# Altium schematic sheet MCU.SchDoc: MCU
size A4; Author: Miłosz Werner; Organization: Wrocław University of Science and Technology; Revision: 1.0; SheetNumber: 1; SheetTotal: 5
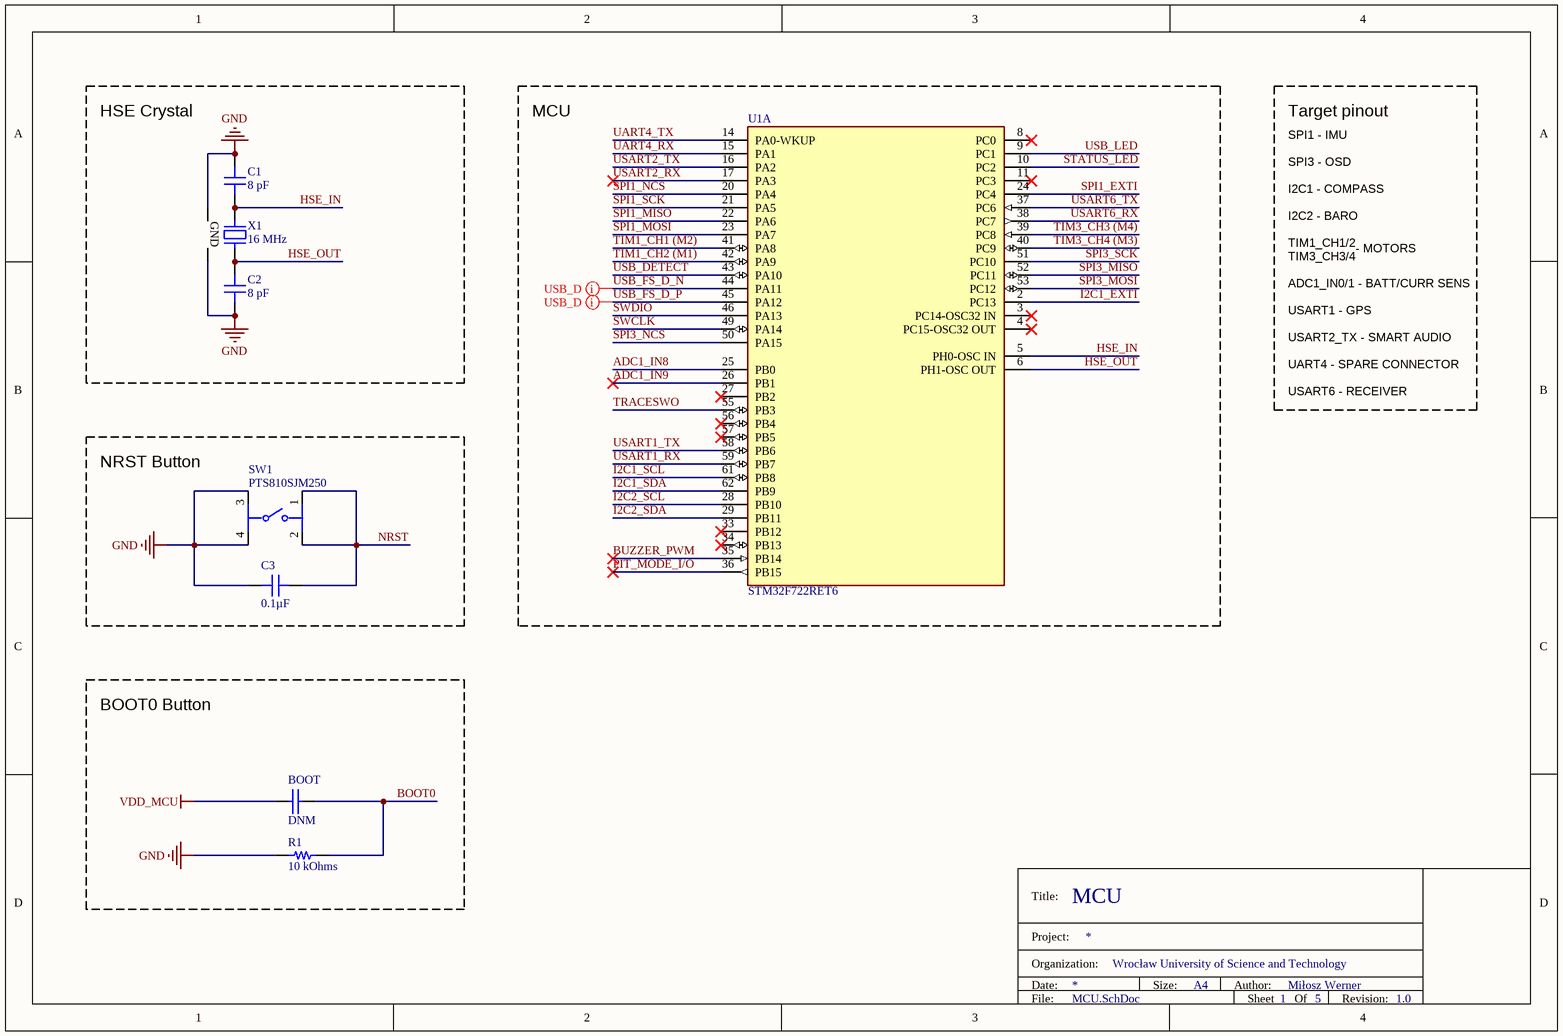
[diagram p0: MCU.SchDoc]

## Parts
BOOT  DNM  [C0603_DNM]  (no BOM)
C1  8 pF  [CAP 0603_1608]
C2  8 pF  [CAP 0603_1608]
C3  0.1µF  [CAP 0603_1608]
R1  10 kOhms  [RES 0603_1608]
SW1  PTS810SJM250  [FP-PTS810SJM250SMTRLFS-MFG]
U1  STM32F722RET6  [FP-LQFP64-5W-IPC_C]  (part A of 2)
X1  16 MHz  [NDK NX3225GA]

## Blocks framed on the sheet
HSE Crystal: C1 C2 X1
MCU: U1
NRST Button: C3 SW1
BOOT0 Button: BOOT R1

## Nets
GND: C1.2 C2.1 C3.2 R1.1 SW1.3 SW1.4 X1.2(GND) X1.4(GND)
VDD_MCU: BOOT.1
ADC1_IN8: U1.25(PB0)
ADC1_IN9: U1.26(PB1)
BOOT0: BOOT.2 R1.2
BUZZER_PWM: U1.35(PB14)
HSE_IN: C1.1 U1.5(PH0-OSC_IN) X1.1
HSE_OUT: C2.2 U1.6(PH1-OSC_OUT) X1.3
I2C1_EXTI: U1.2(PC13)
I2C1_SCL: U1.61(PB8)
I2C1_SDA: U1.62(PB9)
I2C2_SCL: U1.28(PB10)
I2C2_SDA: U1.29(PB11)
NRST: C3.1 SW1.1 SW1.2
PIT_MODE_I/O: U1.36(PB15)
SPI1_EXTI: U1.24(PC4)
SPI1_MISO: U1.22(PA6)
SPI1_MOSI: U1.23(PA7)
SPI1_NCS: U1.20(PA4)
SPI1_SCK: U1.21(PA5)
SPI3_MISO: U1.52(PC11)
SPI3_MOSI: U1.53(PC12)
SPI3_NCS: U1.50(PA15)
SPI3_SCK: U1.51(PC10)
STATUS_LED: U1.10(PC2)
SWCLK: U1.49(PA14)
SWDIO: U1.46(PA13)
TIM1_CH1 (M2): U1.41(PA8)
TIM1_CH2 (M1): U1.42(PA9)
TIM3_CH3 (M4): U1.39(PC8)
TIM3_CH4 (M3): U1.40(PC9)
TRACESWO: U1.55(PB3)
UART4_RX: U1.15(PA1)
UART4_TX: U1.14(PA0-WKUP)
USART1_RX: U1.59(PB7)
USART1_TX: U1.58(PB6)
USART2_RX: U1.17(PA3)
USART2_TX: U1.16(PA2)
USART6_RX: U1.38(PC7)
USART6_TX: U1.37(PC6)
USB_DETECT: U1.43(PA10)
USB_FS_D_N: U1.44(PA11)
USB_FS_D_P: U1.45(PA12)
USB_LED: U1.9(PC1)

Not connected (* = marked no-connect by the designer): U1 3(PC14-OSC32_IN)* 4(PC15-OSC32_OUT)* 8(PC0)* 11(PC3)* 27(PB2)* 33(PB12)* 34(PB13)* 56(PB4)* 57(PB5)*

## Layout directives
differential pair: USB_FS_D_N, USB_FS_D_P

## Notes on the sheet
- Target pinout
- SPI1 - IMU
- SPI3 - OSD
- I2C1 - COMPASS
- TIM1_CH1/2
- TIM3_CH3/4
- I2C2 - BARO
- - MOTORS
- ADC1_IN0/1 - BATT/CURR SENS
- USART1 - GPS
- USART2_TX - SMART AUDIO
- UART4 - SPARE CONNECTOR
- USART6 - RECEIVER
- Title:
- Date:
- File:
- Project:
- Organization:
- Size:
- A4
- Author:
- Sheet
- Of
- Revision:

## Library data of the parts
BOOT = CAP_0603_DNM: CAP 0603 DO NOT MOUNT
C1 C2 = CGA3E2C0G1H080D080AA: CAP CER 8PF 50V C0G 0603; manufacturer: TDK Corporation; Temperature Coefficient: C0G, NP0; Tolerance: ±0.5pF; Part Number: CGA3E2C0G1H080D080AA; Value: 8 pF; Applications: Automotive; Capacitance: 8 pF; componentlink1description: Datasheet; componentlink1url: https://product.tdk.com/info/en/catalog/datasheets/mlcc_automotive_general_en.pdf?ref_disty=digikey; componentlink2description: DigiKey Link; componentlink2url: https://www.digikey.com/en/products/detail/tdk-corporation/CGA3E2C0G1H080D080AA/2443104; Device Package: 0603 (1608 Metric); lastupdated: 19.09.2022 13:00:41; Lifecycle Status: Active; Minimum Order: 1; Mounting Type: Surface Mount, MLCC; Operating Temperature: -55°C ~ 125°C; Package / Case: 0603 (1608 Metric); packaging: TapeAndReel; partid: 15270; Part Status: Active; price: 0.02; Ratings: AEC-Q200; series: CGA; Size / Dimension: 0.063" L x 0.031" W (1.60mm x 0.80mm); Supplier 1: DigiKey; Supplier Part Number 1: 445-5626-1-ND; Thickness (Max): 0.035" (0.90mm); Voltage - Rated: 50V
C3 = 06033C104JAT4A: CAP CER 0.1UF 25V X7R 0603; manufacturer: AVX Corporation; Tolerance: ±5%; Part Number: 06033C104JAT4A; Value: 0.1µF; Applications: General Purpose; Capacitance: 0.1µF; componentlink1description: Datasheet; componentlink1url: http://datasheets.avx.com/X7RDielectric.pdf; componentlink2description: DigiKey Link; componentlink2url: http://digikey.com/product-detail/en/avx-corporation/06033C104JAT4A/478-11510-1-ND/8107711; Device Package: 0603 (1608 Metric); lastupdated: 02.09.2020 01:03:22; Lifecycle Status: Active; Minimum Order: 1; Mounting Type: Surface Mount, MLCC; Operating Temperature: -55°C ~ 125°C; Package / Case: 0603 (1608 Metric); packaging: TapeAndReel; partid: 10083; Part Status: Active; price: 0.06; series: -; Size / Dimension: 0.063" L x 0.032" W (1.60mm x 0.81mm); Supplier 1: DigiKey; Supplier Part Number 1: 478-11510-1-ND; Temperature Coefficient: X7R; Thickness (Max): 0.035" (0.90mm); Voltage - Rated: 25V
R1 = RS73F1JTTD1002B: RES 10K OHM 0.1% 1/5W 0603; Manufacturer: KOA Speer Electronics, Inc.; Power (Watts): 0.2W, 1/5W; Temperature Coefficient: ±25ppm/°C; Part Number: RS73F1JTTD1002B; Value: 10 kOhms; ComponentLink1Description: Datasheet; ComponentLink1URL: http://www.koaspeer.com/pdfs/RS73.pdf; ComponentLink2Description: DigiKey Link; ComponentLink2URL: https://www.digikey.com/en/products/detail/koa-speer-electronics-inc/RS73F1JTTD1002B/11594389; Composition: Thick Film; Device Package: 0603 (1608 Metric); Features: Automotive AEC-Q200, Moisture Resistant; Height - Seated (Max): 0.022" (0.55mm); LastUpdated: 15.07.2022 11:48:43; Lifecycle Status: Active; Minimum Order: 1; Number of Terminations: 2; Operating Temperature: -55°C ~ 155°C; Package / Case: 0603 (1608 Metric); Packaging: TapeAndReel; PartId: 56378; Part Status: Active; Price: 0.08; Ratings: AEC-Q200; Resistance: 10 kOhms; Series: RS73; Size / Dimension: 0.063" L x 0.031" W (1.60mm x 0.80mm); Supplier 1: DigiKey; Supplier Part Number 1: 2019-RS73F1JTTD1002BCT-ND; Supplier Device Package: 0603; Tolerance: ±0.1%
SW1 = CMP-10040-000001-2: SWITCH TACTILE SPST-NO 0.05A 16V; Throw Configuration: SPST; Operating Force: 160gf; Actuator Type: Standard; Switch Travel: 0.15mm; Switch Function: Off-Mom; Max Current Rating: 50mA; Mechanical Life: 150000Cycles; Illumination Type: Non-Illuminated; Package Quantity: 2900; Depth: 4.6mm; Mount: Surface Mount; Packaging: Tape and Reel; Length: 3.2mm; RoHS Compliant: Yes; Case/Package: SMD/SMT; Voltage Rating (DC): 16V; Min Operating Temperature: -40°C; Termination: J-Bend; Lead Free: Lead Free; Contact Plating: Silver; Orientation: Straight; Max Operating Temperature: 85°C; Current Rating: 50mA; Color: Black
U1 = CMP-12105-000139-1: IC MCU 32BIT 512KB FLASH 64LQFP; Interface: I2C; Number of I/Os: 50; Peripherals: Brown-out Detect/Reset; Core Architecture: ARM; Oscillator Type: Internal; Frequency: 216MHz; Memory Size: 512KB; Min Operating Temperature: -40°C; Max Operating Temperature: 85°C; Mount: Surface Mount; Case/Package: LQFP; Memory Type: FLASH; Packaging: Tray
X1 = NX3225GA-16.000M-STD-CRG-2: CRYSTAL 16.0000MHZ 8PF SMD; Manufacturer: NDK America, Inc.; ESR (Equivalent Series Resistance): 80 Ohms; Frequency Stability: ±30ppm; Frequency Tolerance: ±20ppm; Operating Mode: Fundamental; Part Number: NX3225GA-16.000M-STD-CRG-2; ComponentLink1Description: Datasheet; ComponentLink1URL: http://www.ndk.com/images/products/catalog/c_NX3225GA-STD-CRG-2_e.pdf; ComponentLink2Description: DigiKey Link; ComponentLink2URL: https://www.digikey.com/en/products/detail/ndk-america-inc/NX3225GA-16-000M-STD-CRG-2/3125634; Frequency: 16 MHz; Height - Seated (Max): 0.035" (0.90mm); LastUpdated: 19.09.2022 13:51:54; Lifecycle Status: Active; Load Capacitance: 8pF; Minimum Order: 1; Mounting Type: Surface Mount; Operating Temperature: -40°C ~ 85°C; Package / Case: 4-SMD, No Lead; Packaging: TapeAndReel; PartId: 549; Part Status: Active; Price: 0.33; Series: NX3225GA; Size / Dimension: 0.126" L x 0.098" W (3.20mm x 2.50mm); Supplier 1: DigiKey; Supplier Part Number 1: 644-1175-1-ND; Type: MHz Crystal; Value: 16 MHz